# EAGLE design remote_mini (EAGLE 7.6.0)
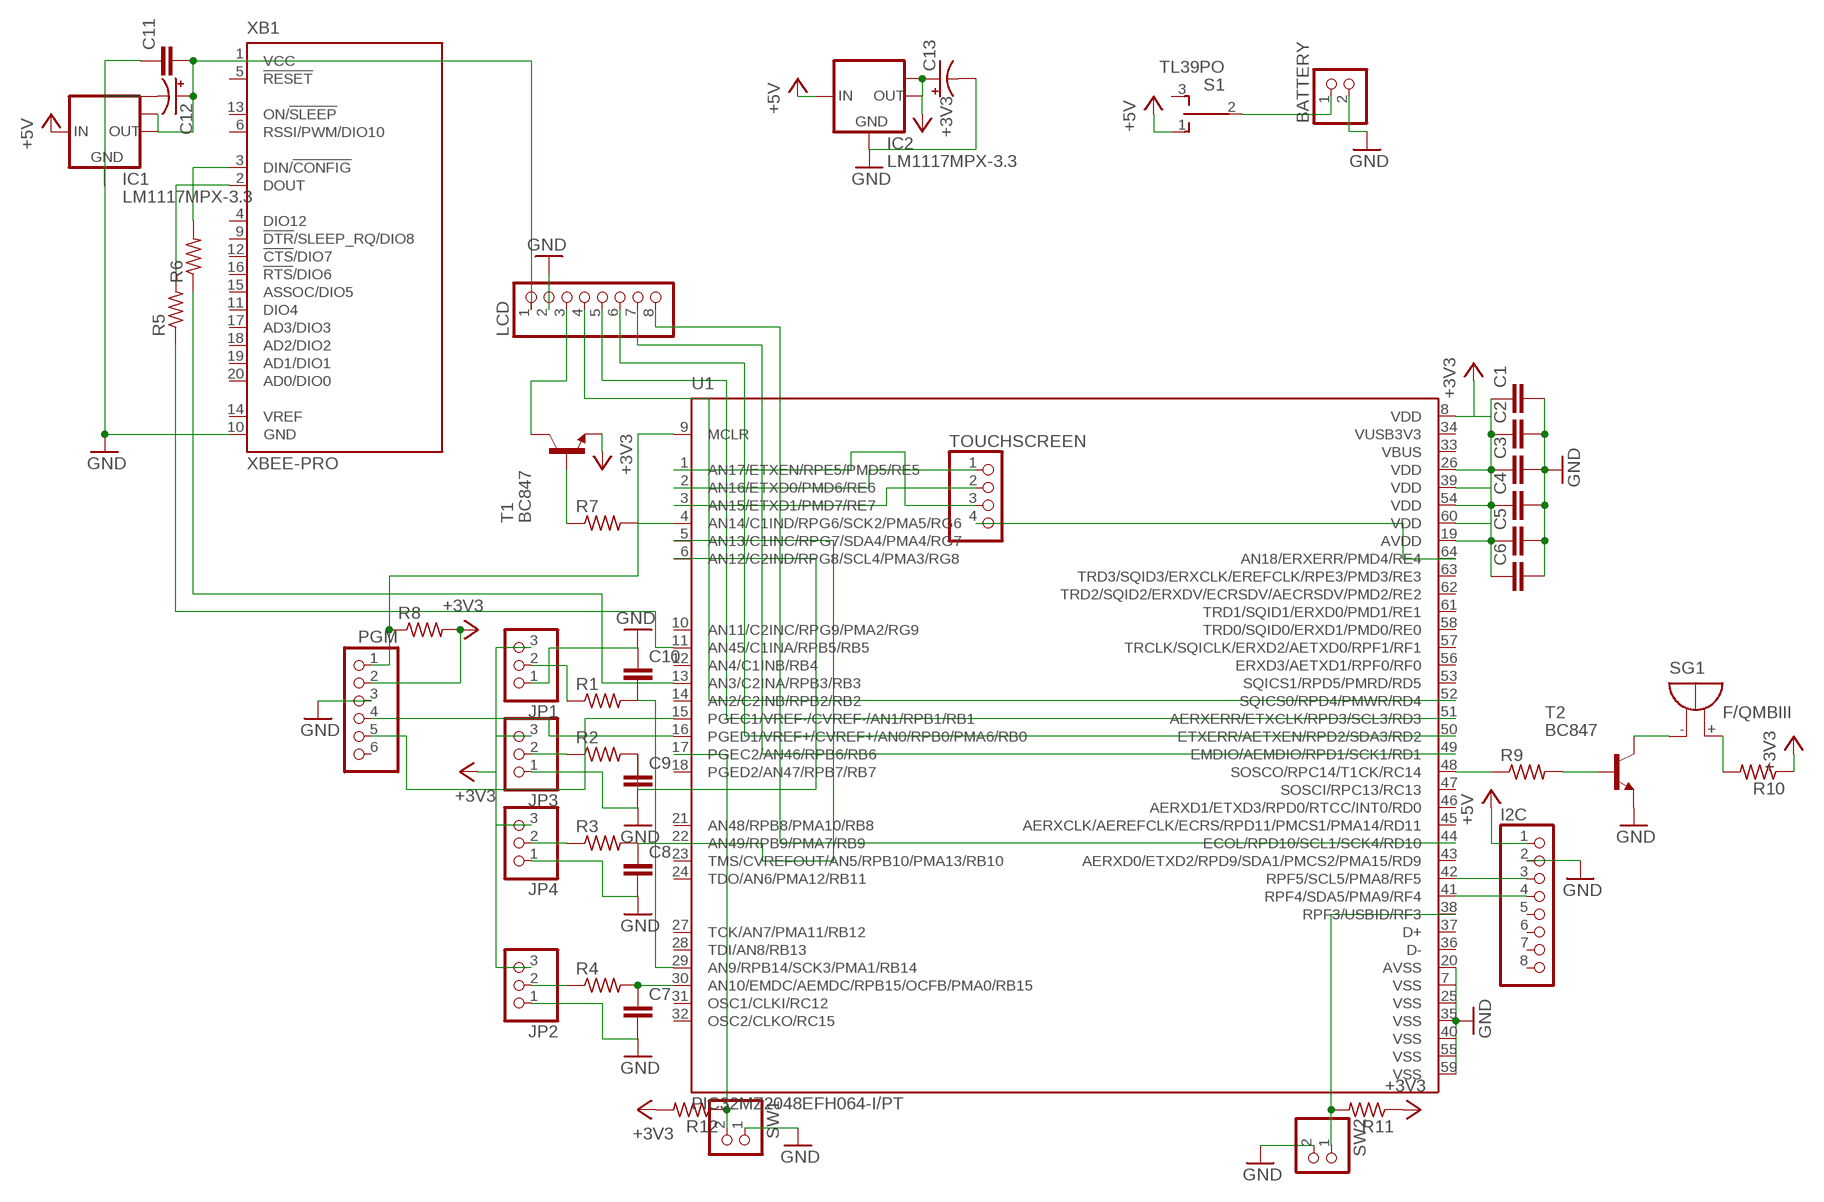
[diagram p0: schematic, sheet 1]

## Parts
BATTERY  PINHD-1X2  [1X02]
C1  C-EUC0603  [C0603]
C2  C-EUC0603  [C0603]
C3  C-EUC0603  [C0603]
C4  C-EUC0603  [C0603]
C5  C-EUC0603  [C0603]
C6  C-EUC0603  [C0603]
C7  C-EUC0805  [C0805]
C8  C-EUC0805  [C0805]
C9  C-EUC0805  [C0805]
C10  C-EUC0805  [C0805]
C11  C-EUC0603  [C0603]
C12  CPOL-USCT7343  [CT7343]
C13  CPOL-USCT7343  [CT7343]
I2C  PINHD-1X8  [1X08]
IC1  LM1117MPX-3.3  [SOT223]
IC2  LM1117MPX-3.3  [SOT223]
JP1  PINHD-1X3  [1X03]
JP2  PINHD-1X3  [1X03]
JP3  PINHD-1X3  [1X03]
JP4  PINHD-1X3  [1X03]
LCD  PINHD-1X8  [1X08]
PGM  PINHD-1X6  [1X06]
R1  R-US_R0603  [R0603]
R2  R-US_R0603  [R0603]
R3  R-US_R0603  [R0603]
R4  R-US_R0603  [R0603]
R5  R-US_R0603  [R0603]
R6  R-US_R0603  [R0603]
R7  R-US_R0603  [R0603]
R8  R-US_R0603  [R0603]
R9  R-US_R0603  [R0603]
R10  R-US_R0603  [R0603]
R11  R-US_R0603  [R0603]
R12  R-US_R0603  [R0603]
S1  TL39PO  [TL3XPO]
SG1  F/QMBIII  [F/QMBIII]
SW1  PINHD-1X2  [1X02]
SW2  PINHD-1X2  [1X02]
T1  BC847  [SOT23]
T2  BC847  [SOT23]
TOUCHSCREEN  PINHD-1X4  [1X04]
U1  PIC32MZ2048EFH064-I/PT  [QFP50P1200X1200X120-64N]
XB1  XBEE-PRO  [XBEE-PRO]

## Nets
+3V3: C1.1 C2.1 C3.1 C4.1 C5.1 C6.1 C13.+ IC2.2(OUT) IC2.TAB(OUT1) JP1.3 JP2.3 JP3.3 JP4.3 PGM.2 R8.2 R10.1 R11.1 R12.2 T1.2(E) U1.8(VDD) U1.19(AVDD) U1.26(VDD) U1.39(VDD) U1.54(VDD) U1.60(VDD)
+5V: I2C.1 IC1.3(IN) IC2.3(IN) S1.1(O)
GND: BATTERY.2 C1.2 C2.2 C3.2 C4.2 C5.2 C6.2 C7.2 C8.2 C9.2 C10.1 C11.1 C12.- C13.- I2C.2 IC1.1(GND) IC2.1(GND) JP1.1 JP2.1 JP3.1 JP4.1 LCD.2 PGM.3 SW1.1 SW2.2 T2.2(E) U1.7(VSS) U1.20(AVSS) U1.25(VSS) U1.35(VSS) U1.40(VSS) U1.55(VSS) U1.59(VSS) XB1.10(GND)
N$1: R9.1 U1.48(SOSCO/RPC14/T1CK/RC14)
N$2: C7.1 R4.2 U1.30(AN10/EMDC/AEMDC/RPB15/OCFB/PMA0/RB15)
N$3: JP2.2 R4.1
N$4: C11.2 C12.+ IC1.2(OUT) IC1.TAB(OUT1) LCD.1 XB1.1(VCC)
N$5: LCD.6 U1.50(ETXERR/AETXEN/RPD2/SDA3/RD2)
N$6: R5.1 U1.11(AN45/C1INA/RPB5/RB5)
N$7: R5.2 XB1.2(DOUT)
N$8: R6.1 U1.13(AN3/C2INA/RPB3/RB3)
N$9: R6.2 XB1.3(DIN/!CONFIG)
N$10: C10.2 R1.2 U1.29(AN9/RPB14/SCK3/PMA1/RB14)
N$11: JP4.2 R3.1
N$12: C8.1 R3.2 U1.5(AN13/C1INC/RPG7/SDA4/PMA4/RG7)
N$13: JP3.2 R2.1
N$14: JP1.2 R1.1
N$15: LCD.5 U1.51(AERXERR/ETXCLK/RPD3/SCL3/RD3)
N$16: LCD.4 U1.52(SQICS0/RPD4/PMWR/RD4)
N$17: LCD.7 U1.49(EMDIO/AEMDIO/RPD1/SCK1/RD1)
N$18: LCD.8 U1.44(ECOL/RPD10/SCL1/SCK4/RD10)
N$19: R7.2 U1.4(AN14/C1IND/RPG6/SCK2/PMA5/RG6)
N$20: R7.1 T1.1(B)
N$21: LCD.3 T1.3(C)
N$22: BATTERY.1 S1.2(P)
N$23: I2C.3 U1.42(RPF5/SCL5/PMA8/RF5)
N$24: I2C.4 U1.41(RPF4/SDA5/PMA9/RF4)
N$25: PGM.1 R8.1 U1.9(MCLR)
N$26: PGM.4 U1.16(PGED1/VREF+/CVREF+/AN0/RPB0/PMA6/RB0)
N$27: PGM.5 U1.15(PGEC1/VREF-/CVREF-/AN1/RPB1/RB1)
N$30: R9.2 T2.1(B)
N$31: C9.1 R2.2 U1.6(AN12/C2IND/RPG8/SCL4/PMA3/RG8)
N$32: SG1.-(+) T2.3(C)
N$33: R10.2 SG1.+(-)
N$34: R11.2 SW2.1 U1.38(RPF3/USBID/RF3)
N$35: R12.1 SW1.2 U1.17(PGEC2/AN46/RPB6/RB6)
N$36: TOUCHSCREEN.3 U1.1(AN17/ETXEN/RPE5/PMD5/RE5)
N$37: TOUCHSCREEN.1 U1.2(AN16/ETXD0/PMD6/RE6)
N$38: TOUCHSCREEN.2 U1.3(AN15/ETXD1/PMD7/RE7)
N$39: TOUCHSCREEN.4 U1.64(AN18/ERXERR/PMD4/RE4)
Unconnected: I2C.5 I2C.6 I2C.7 I2C.8 PGM.6 S1.3(S) U1.10(AN11/C2INC/RPG9/PMA2/RG9) U1.12(AN4/C1INB/RB4) U1.14(AN2/C2INB/RPB2/RB2) U1.18(PGED2/AN47/RPB7/RB7) U1.21(AN48/RPB8/PMA10/RB8) U1.22(AN49/RPB9/PMA7/RB9) U1.23(TMS/CVREFOUT/AN5/RPB10/PMA13/RB10) U1.24(TDO/AN6/PMA12/RB11) U1.27(TCK/AN7/PMA11/RB12) U1.28(TDI/AN8/RB13) U1.31(OSC1/CLKI/RC12) U1.32(OSC2/CLKO/RC15) U1.36(D-) U1.37(D+) U1.43(AERXD0/ETXD2/RPD9/SDA1/PMCS2/PMA15/RD9) U1.45(AERXCLK/AEREFCLK/ECRS/RPD11/PMCS1/PMA14/RD11) U1.46(AERXD1/ETXD3/RPD0/RTCC/INT0/RD0) U1.47(SOSCI/RPC13/RC13) U1.53(SQICS1/RPD5/PMRD/RD5) U1.56(ERXD3/AETXD1/RPF0/RF0) U1.57(TRCLK/SQICLK/ERXD2/AETXD0/RPF1/RF1) U1.58(TRD0/SQID0/ERXD1/PMD0/RE0) U1.61(TRD1/SQID1/ERXD0/PMD1/RE1) U1.62(TRD2/SQID2/ERXDV/ECRSDV/AECRSDV/PMD2/RE2) U1.63(TRD3/SQID3/ERXCLK/EREFCLK/RPE3/PMD3/RE3) XB1.4(DIO12) XB1.5(!RESET) XB1.6(RSSI/PWM/DIO10) XB1.9(!DTR!/SLEEP_RQ/DIO8) XB1.11(DIO4) XB1.12(!CTS!/DIO7) XB1.13(ON/!SLEEP) XB1.14(VREF) XB1.15(ASSOC/DIO5) XB1.16(!RTS!/DIO6) XB1.17(AD3/DIO3) XB1.18(AD2/DIO2) XB1.19(AD1/DIO1) XB1.20(AD0/DIO0)

## Power pins joined to a net without a drawn wire
VBUS: U1.33(VBUS)
VUSB3V3: U1.34(VUSB3V3)

## Library data of the parts
BATTERY SW1 SW2 = pinhead:PINHD-1X2: PIN HEADER
C1-C11 = rcl:C-EU: CAPACITOR, European symbol
C12 C13 = rcl:CPOL-US: POLARIZED CAPACITOR, American symbol
I2C LCD = pinhead:PINHD-1X8: PIN HEADER
IC1 IC2 = lm1117:LM1117MPX-*
JP1-JP4 = pinhead:PINHD-1X3: PIN HEADER
PGM = pinhead:PINHD-1X6: PIN HEADER
R1-R12 = rcl:R-US_: RESISTOR, American symbol
S1 = switch:TL39PO: TINY SWITCH ON OFF ON Source: http://www2.produktinfo.conrad.com/datenblaetter/700000-724999/705152-da-01-de-Subminiaturschalter_TL_36YO.pdf
SG1 = buzzer:F/QMBIII: BUZZER Source: Buerklin; OC_FARNELL: unknown; OC_NEWARK: unknown
T1 T2 = transistor:BC847: NPN TRANSISTOR
TOUCHSCREEN = pinhead:PINHD-1X4: PIN HEADER
U1 = PIC32MZ2048EFH064-I_PT:PIC32MZ2048EFH064-I/PT: PIC32MZ Series 2 MB Flash 512 kB RAM 200 MHz 32-Bit Microcontroller - TQFP-64; AVAILABILITY: Good; DESCRIPTION: PIC32MZ Series 2 MB Flash 512 kB RAM 200 MHz 32-Bit Microcontroller - TQFP-64; MF: Microchip; MP: PIC32MZ2048EFH064-I/PT; PACKAGE: TQFP-64 Microchip; PRICE: 11.29 USD
XB1 = xbee:XBEE: XBee (TM) /XBee-PRO(TM) OEM RF Modules Source: MaxStream, Inc. xbee_productmanual.pdf; MPN: XBP24-AWI-001; OC_FARNELL: 1337916; OC_NEWARK: 42M2667

## Board
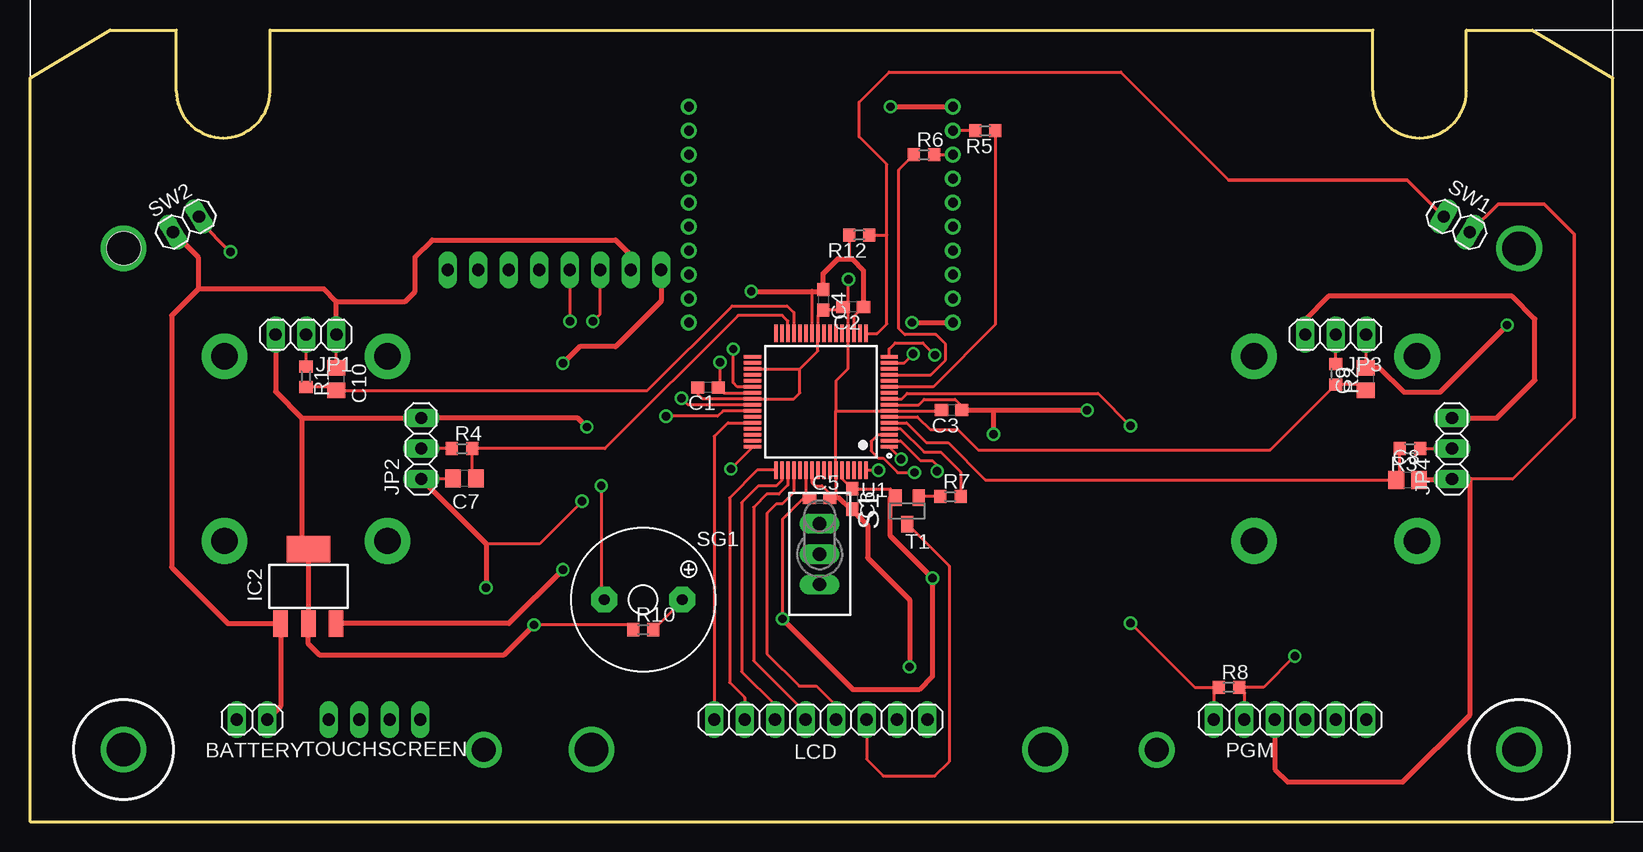
[diagram p1: board, top side]
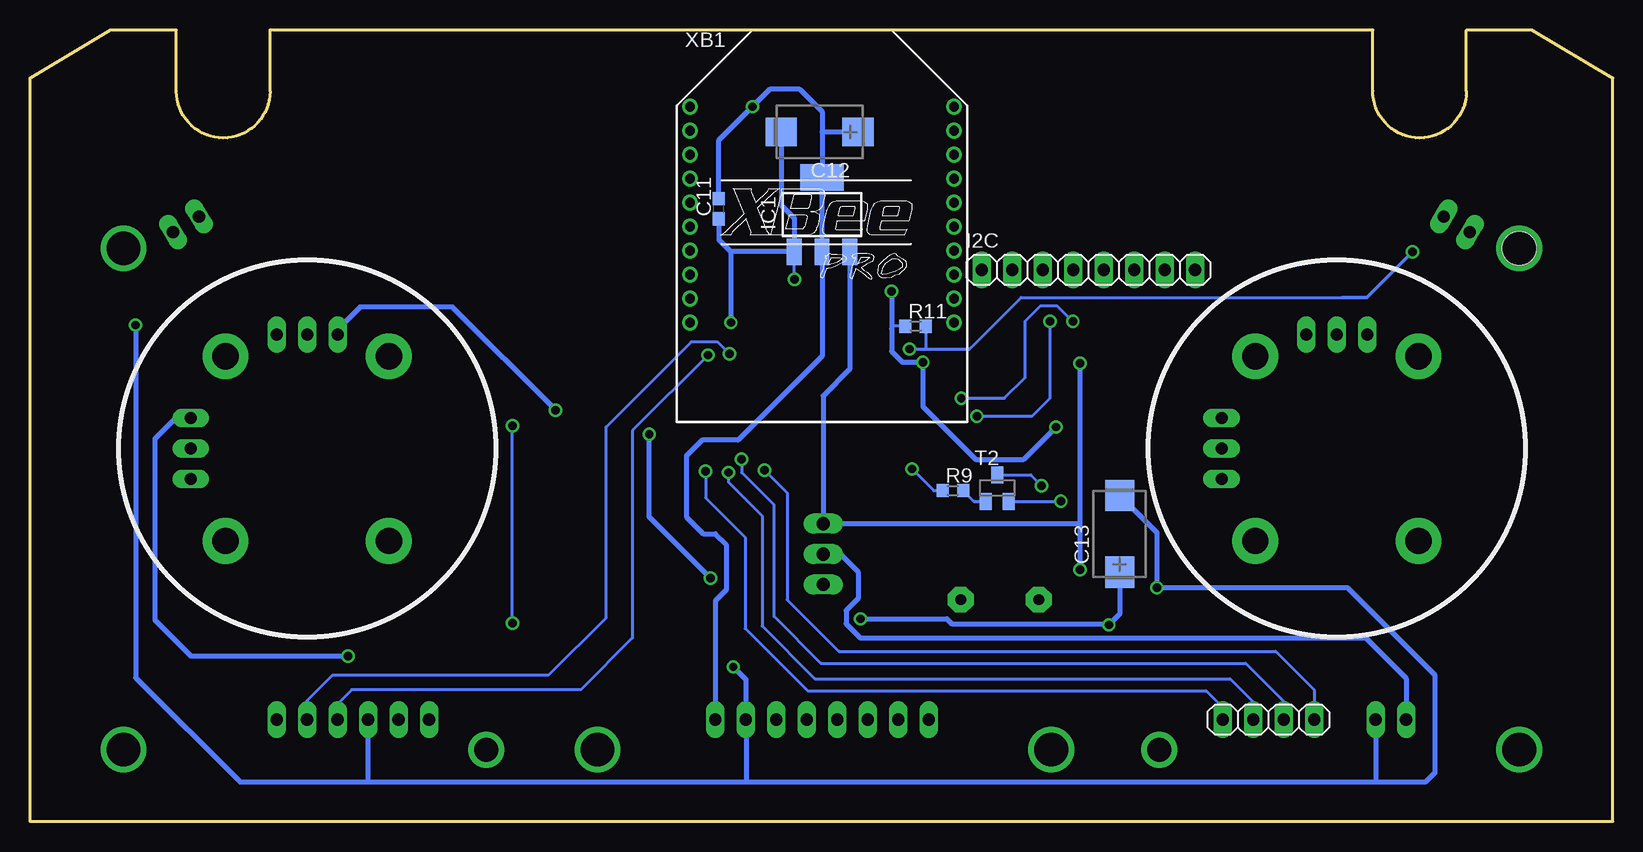
[diagram p2: board, bottom side, seen from below]

Size 131.9 x 66 mm. Coordinates in mm from the lower left corner, seen from the top.
Outline: 0,0 0,62 6.7,66 12.2,66 12.2,60.9 arc90 16.1,57 arc90 20,60.9 20,66 111.9,66 111.9,60.9 arc90 115.8,57 arc90 119.7,60.9 119.7,66 125.2,66 131.9,62 131.9,0 0,0
Copper layers (1*16): Top 0.035mm / dielectric 1.5mm / Bottom 0.035mm
Design rules "default": minimum track width 10mil, minimum drill 24mil, track to track 8mil, track to pad 8mil, pad to pad 8mil, via to via 8mil, smd to smd 8mil, copper to edge 40mil, drill to drill 8mil, minimum pad ring 10mil, minimum via ring 8mil, stop-mask expansion 4mil, vias tented up to drill 0mil, thermal gap 10mil
Holes 2.8 mm at 7.8,47.8

### Footprints (pad centres in the part's own frame; a part is rotated, then mirrored left to right if it is on the bottom)
1X02 = drill 1.016 long: 1 -1.27,0; 2 1.27,0
C0603 = smd 1.1 x 1: 1 -0.85,0; 2 0.85,0
C0805 = smd 1.3 x 1.5: 1 -0.95,0; 2 0.95,0
CT7343 = smd 2.6 x 2.4: + -3.2,0; - 3.2,0
1X08 = drill 1.016 long: 1 -8.89,0; 2 -6.35,0; 3 -3.81,0; 4 -1.27,0; 5 1.27,0; 6 3.81,0; 7 6.35,0; 8 8.89,0
SOT223 = smd 1.219 x 2.235: 1 -2.311,-3.099; 2 0,-3.099; 3 2.311,-3.099 | smd 3.6 x 2.2: TAB 0,3.099
1X03 = drill 1.016 long: 1 -2.54,0; 2 0,0; 3 2.54,0
1X06 = drill 1.016 long: 1 -6.35,0; 2 -3.81,0; 3 -1.27,0; 4 1.27,0; 5 3.81,0; 6 6.35,0
R0603 = smd 1 x 1.1: 1 -0.85,0; 2 0.85,0
TL3XPO = drill 1.1 pad 1.422 long: 1 -2.54,0; 2 0,0; 3 2.54,0
F/QMBIII = drill 0.914 pad 2.159 octagon: + 3.251,0; - -3.251,0
SOT23 = smd 1 x 1.4: 1 -0.95,-1.1; 2 0.95,-1.1; 3 0,1.1
1X04 = drill 1.016 long: 1 -3.81,0; 2 -1.27,0; 3 1.27,0; 4 3.81,0
QFP50P1200X1200X120-64N = smd 1.45 x 0.3: 1 -5.7,3.75; 2 -5.7,3.25; 3 -5.7,2.75; 4 -5.7,2.25; 5 -5.7,1.75; 6 -5.7,1.25; 7 -5.7,0.75; 8 -5.7,0.25; 9 -5.7,-0.25; 10 -5.7,-0.75; 11 -5.7,-1.25; 12 -5.7,-1.75; 13 -5.7,-2.25; 14 -5.7,-2.75; 15 -5.7,-3.25; 16 -5.7,-3.75; 33 5.7,-3.75; 34 5.7,-3.25; 35 5.7,-2.75; 36 5.7,-2.25; 37 5.7,-1.75; 38 5.7,-1.25; 39 5.7,-0.75; 40 5.7,-0.25; 41 5.7,0.25; 42 5.7,0.75; 43 5.7,1.25; 44 5.7,1.75; 45 5.7,2.25; 46 5.7,2.75; 47 5.7,3.25; 48 5.7,3.75 | smd 0.3 x 1.45: 17 -3.75,-5.7; 18 -3.25,-5.7; 19 -2.75,-5.7; 20 -2.25,-5.7; 21 -1.75,-5.7; 22 -1.25,-5.7; 23 -0.75,-5.7; 24 -0.25,-5.7; 25 0.25,-5.7; 26 0.75,-5.7; 27 1.25,-5.7; 28 1.75,-5.7; 29 2.25,-5.7; 30 2.75,-5.7; 31 3.25,-5.7; 32 3.75,-5.7; 49 3.75,5.7; 50 3.25,5.7; 51 2.75,5.7; 52 2.25,5.7; 53 1.75,5.7; 54 1.25,5.7; 55 0.75,5.7; 56 0.25,5.7; 57 -0.25,5.7; 58 -0.75,5.7; 59 -1.25,5.7; 60 -1.75,5.7; 61 -2.25,5.7; 62 -2.75,5.7; 63 -3.25,5.7; 64 -3.75,5.7
XBEE-PRO = drill 0.8 pad 1.27: 1 -11,9; 2 -11,7; 3 -11,5; 4 -11,3; 5 -11,1; 6 -11,-1; 7 -11,-3; 8 -11,-5; 9 -11,-7; 10 -11,-9; 11 11,-9; 12 11,-7; 13 11,-5; 14 11,-3; 15 11,-1; 16 11,1; 17 11,3; 18 11,5; 19 11,7; 20 11,9

### Placement (x,y rotation side)
BATTERY  18.5,8.5 0 top
C1  56.5,36.2 180 top
C2  68.6,42.9 180 top
C3  76.8,34.3 180 top
C4  66.1,43.5 270 top
C5  65.8,27 0 top
C6  68.5,26.9 270 top
C7  36.2,28.6 180 top
C8  114.8,28.5 0 top
C9  111.3,36.9 90 top
C10  25.5,36.9 270 top
C11  74.5,51.1 90 bottom
C12  66.1,57.5 180 bottom
C13  41.1,24 90 bottom
I2C  43.7,46 0 bottom
IC1  65.9,50.6 0 bottom
IC2  23.2,19.6 0 top
JP1  23,40.6 180 top
JP2  32.6,31.1 90 top
JP3  108.8,40.6 180 top
JP4  118.5,31.1 90 top
LCD  65.9,8.5 180 top
PGM  105,8.5 0 top
R1  23,37.1 270 top
R2  108.8,37.3 270 top
R3  115,31.1 180 top
R4  36,31.1 0 top
R5  79.6,57.6 180 top
R6  74.5,55.6 0 top
R7  76.7,27.1 0 top
R8  99.9,11.2 0 top
R9  55,27.6 0 bottom
R10  51.1,16 0 top
R11  58.1,41.3 0 bottom
R12  69.1,48.9 180 top
S1  65.8,22.3 270 top
SG1  51.1,18.5 0 top
SW1  118.9,49.8 149.2 top
SW2  13,49.8 210.8 top
T1  73.1,25.9 180 top
T2  51.3,27.8 0 bottom
TOUCHSCREEN  28.7,8.5 0 bottom
U1  65.9,35 180 top
XB1  65.9,50.6 0 bottom

### Tracks (layer width: path | path; a pad name or v marks a point on that pad's centre or on a via)
+3V3  (via drill 0.7)
  Top 0.254: U1.60 67.65,28.6 C6.1 71.7,27.75 71.7,27 T1.2 | C5.1 64.65,27.1 64.65,27.15 | U1.39 57.8,35.75 C1.1 57.5,36.35 v57.5,38.3 | 65.15,44.2 U1.26 | C2.1 68.65,42.1 U1.19 | U1.54 64.65,27.15 | 64.65,27.15 62.7,25.2 v62.7,16.9 | 66.1,44.2 C4.1 | U1.8 74.05,34.75 74.5,35.2 77.1,35.2 77.65,34.65 C3.1 | R12.2 68.25,46.95 68.2,46.9 | PGM.2 101.19,10.76 R8.2 102.8,11.2 v105.4,13.8 | R10.1 49.85,16.4 v42,16.4
  Top 0.406: JP1.3 20.46,35.84 22.66,33.64 | 22.66,33.64 JP2.3 45.66,33.64 v46.4,32.9 | C3.1 80.4,34.3 | 80.4,34.3 v88.1,34.3 | JP4.3 122.24,33.64 125.4,36.8 125.4,41.9 123.5,43.8 108.2,43.8 106.26,41.86 JP3.3 | v60.1,44.2 65.15,44.2 66.1,44.2 66.1,45.7 67.3,46.9 68.2,46.9 68.5,46.9 69.45,45.95 C2.1 | v80.3,32.3 80.3,34.2 80.4,34.3 | 71.7,27 71.7,23.8 v75.2,20.3 75.2,12.1 74.1,11 68.6,11 v62.7,16.9 | 22.66,33.64 22.66,23.24 IC2.TAB IC2.2 23.2,14.8 24.1,13.9 39.5,13.9 v42,16.4
  Bottom 0.254: R11.1 59.9,41.3 60.1,41.1
  Bottom 0.406: JP4.3 119.76,33.64 121.5,31.9 121.5,16.8 118.5,13.8 v105.4,13.8 | v88.1,34.3 96.7,42.9 104.4,42.9 106.26,41.04 JP3.3 | v46.4,32.9 49.1,30.2 53.1,30.2 57.5,34.6 v57.5,38.3 59.2,38.3 60.1,39.2 60.1,41.1 v60.1,44.2 | v75.2,20.3 80.3,25.4 v80.3,32.3 | v62.7,16.9 55.5,16.9 55.1,16.5 42.1,16.5 v42,16.4 41.1,17.3 C13.+
+5V  (via drill 0.7)
  Top 0.406: I2C.1 52.59,43.39 48.8,39.6 45.8,39.6 v44.4,38.2 | IC2.3 39.9,16.5 v44.4,21
  Bottom 0.406: IC1.3 63.59,37.71 65.8,35.5 S1.1 44.46,24.84 | v44.4,38.2 44.4,24.9 44.46,24.84 | v44.4,21 44.4,24.78 44.46,24.84
GND  (via drill 0.7)
  Top 0.254: C9.2 111.34,37.89 JP3.1 | C8.2 115.81,28.56 | C10.1 25.54,37.89 JP1.1 | C7.2 35.21,28.56 JP2.1 | 68.35,26.05 C6.2 68.5,26 | 67.2,27 67.15,27.05 U1.59 67.15,34.25 | 67.15,34.25 U1.7 75.9,34.25 C3.2 | C2.2 67.5,42.65 C4.2 65.65,42.2 U1.25 65.65,39.25 64.15,37.75 | C2.2 68.15,42.5 U1.20 68.15,37.75 67.15,36.75 67.15,34.25 | C2.2 68.2,43.35 v68.2,45.2 | U1.55 65.15,28.25 65.4,28 66,28 66.65,27.35 C5.2 | U1.35 64.15,37.75 | 64.15,37.75 64.15,35.75 63.65,35.25 U1.40 56.05,35.25 55.65,35.65 C1.2 | v46,26.7 42.46,23.16 38,23.16 | 128.7,33.7 123.56,28.56 120,28.56
  Top 0.305: SW1.1 122.34,51.5 126.2,51.5 128.7,49 128.7,33.7
  Top 0.406: v73.5,41.6 XB1.10 | 68.35,26.05 67.4,27 67.2,27 C5.2 | JP1.1 25.54,43.36 | 25.54,43.36 24.5,44.4 14,44.4 | 14,44.4 11.8,42.2 11.8,21.2 16.5,16.5 IC2.1 20.89,9.62 BATTERY.2 | 25.54,43.36 31.26,43.36 32.1,44.2 32.1,47.1 33.5,48.5 48.8,48.5 50.05,47.25 I2C.2 | PGM.3 103.73,4.37 104.8,3.3 114.4,3.3 120,8.9 120,28.56 JP4.1 118.44,28.5 C8.2 | C9.2 112.45,37.85 114.5,35.8 117.5,35.8 v123.1,41.4 | JP2.1 38,23.16 v38,19.5 | SW2.2 14,47.06 14,44.4 | 68.5,26 69.8,24.7 69.8,22 73.3,18.5 v73.3,12.9
  Bottom 0.254: v68.2,45.2 v68.21,45.21 IC1.1 | T2.2 v46,26.7
  Bottom 0.406: 73.5,47.5 IC1.1 68.21,50.31 69.3,51.4 C12.- | 73.5,47.5 v73.5,41.6 | v123.1,41.4 123.1,12 114.4,3.3 103.73,3.3 | 103.73,3.3 72.2,3.3 | 72.2,3.3 19.7,3.3 | 19.7,3.3 15.6,3.3 14.8,4.1 14.8,12.2 22.1,19.5 v38,19.5 38,24.1 C13.- | 72.2,3.3 72.2,6.05 LCD.2 72.25,11.85 v73.3,12.9 | 103.73,3.3 PGM.3 | BATTERY.2 19.77,3.37 19.7,3.3 | C11.1 74.5,48.5 73.5,47.5
N$1  (via drill 0.7)
  Top 0.254: U1.48 60.2,31.2 v58.4,29.4
  Bottom 0.254: v58.4,29.4 56.6,27.6 R9.1
N$2
  Top 0.254: C7.1 36.85,28.9 R4.2 47.9,31.1 59,42.2 62.7,42.2 63.15,41.75 U1.30
N$3
  Top 0.254: R4.1 JP2.2
N$4  (via drill 0.7)
  Top 0.406: v71.7,59.6 XB1.1
  Bottom 0.406: LCD.1 74.79,18.41 73.9,19.3 73.9,23.1 74.79,23.99 75.79,23.99 77.2,25.4 77.2,30.5 75.9,31.8 72.9,31.8 65.9,38.8 IC1.2 IC1.TAB 65.9,57.5 | C11.2 74.5,56.8 v71.7,59.6 70.2,61.1 67.8,61.1 65.9,59.2 65.9,57.5 | C12.+ 65.9,57.5
N$5
  Top 0.254: U1.50 62.65,28.45 62.2,28 60.7,28 59.3,26.6 59.3,12.5 62.09,9.71 LCD.6
N$6
  Top 0.254: R5.1 80.45,41.45 75.25,36.25 U1.11
N$7
  Top 0.254: R5.2 XB1.2
N$8
  Top 0.254: R6.1 72.4,54.35 72.4,41.1 72.9,40.6 75.5,40.6 76.3,39.8 76.3,38.5 75.05,37.25 U1.13
N$9
  Top 0.254: R6.2 XB1.3
N$10
  Top 0.254: R1.2 25.2,36.25 C10.2 51.45,35.95 58.5,43 63.1,43 63.65,42.45 U1.29
N$11
  Top 0.254: R3.1 JP4.2
N$12
  Top 0.254: R3.2 114.15,28.8 C8.1 79.6,28.5 76.5,31.6 74.7,31.6 73.05,33.25 U1.5
N$13
  Top 0.254: R2.1 JP3.2
N$14
  Top 0.254: R1.1 JP1.2
N$15
  Top 0.254: U1.51 63.15,28.05 62.4,27.3 61.4,27.3 60.3,26.2 60.3,13.4 64.63,9.07 LCD.5
N$16
  Top 0.254: U1.52 63.65,27.45 62.7,26.5 62.2,26.5 61.4,25.7 61.4,14 64.1,11.3 65.5,11.3 67.17,9.63 LCD.4
N$17
  Top 0.254: U1.49 60.6,29.3 58.3,27 58.3,11.6 59.55,10.35 LCD.7
N$18
  Top 0.254: U1.44 58.15,33.25 57.01,32.11 LCD.8
N$19
  Top 0.254: U1.4 72.55,32.75 74.5,30.8 75.9,30.8 77.55,29.15 R7.2
N$20
  Top 0.254: R7.1 74.15,27.1 T1.1
  Top 0.406: 74.2,27.15 T1.1
N$21
  Top 0.254: LCD.3 69.71,5.19 71.1,3.8 75.4,3.8 76.6,5 76.6,21.3 T1.3
N$22
  Bottom 0.406: S1.2 64.4,22.3 62.9,20.8 62.9,18.6 63.9,17.6 63.9,16.5 62.7,15.3 20.6,15.3 17.23,11.93 BATTERY.1
N$23  (via drill 0.7)
  Top 0.254: U1.42 57.75,34.25 57.3,33.8 v53,33.8 | v46.9,41.7 47.51,42.31 I2C.3
  Bottom 0.254: v53,33.8 48.4,33.8 46.9,35.3 v46.9,41.7
N$24  (via drill 0.7)
  Top 0.254: U1.41 54.85,34.75 v54.3,35.3 | v45,41.7 45,46 I2C.4
  Bottom 0.254: v54.3,35.3 50.7,35.3 49,37 49,41.7 47.7,43 46.3,43 v45,41.7
N$25  (via drill 0.7)
  Top 0.254: v91.7,33 89,35.7 73.1,35.7 72.65,35.25 U1.9 | PGM.1 98.65,10.8 R8.1 97.05,11.2 v91.7,16.55
  Bottom 0.254: v91.7,16.55 v91.7,33
N$26  (via drill 0.7)
  Top 0.254: U1.16 71.6,39.4 72.1,39.9 74.4,39.9 v75.4,38.9
  Bottom 0.254: v75.4,38.9 81.7,32.6 81.7,15.3 86,11 105.1,11 106.27,9.83 PGM.4
N$27  (via drill 0.7)
  Top 0.254: U1.15 72.85,38.25 v73.6,39
  Bottom 0.254: v73.6,39 74.6,40 76.8,40 83.9,32.9 83.9,17 88.7,12.2 106.7,12.2 108.81,10.09 PGM.5
N$28  (via drill 2)
  other vias: 93.9,6
N$29  (via drill 2)
  other vias: 37.8,6
N$30
  Bottom 0.254: R9.2 53.25,26.7 T2.1
N$31
  Top 0.254: U1.6 73.95,33.75 75,32.7 77.3,32.7 79,31 103.35,31 R2.2 110.8,36.45 C9.1
N$32  (via drill 0.7)
  Top 0.254: v47.6,28 47.6,18.75 SG1.-
  Bottom 0.254: T2.3 48.5,28.9 v47.6,28
N$33
  Top 0.254: SG1.+ 54.35,18.4 R10.2
N$34  (via drill 0.7)
  Top 0.254: U1.38 58.95,36.25 58.6,36.6 v58.6,39.4
  Top 0.305: v16.7,47.5 14.09,50.11 SW2.1
  Bottom 0.254: v58.6,39.4 57.2,39.4 | 57.2,39.4 53.6,39.4 49.3,43.7 22.54,43.7 | R11.2 57.25,39.45 57.2,39.4
  Bottom 0.305: 22.54,43.7 20.5,43.7 v16.7,47.5
N$35
  Top 0.254: U1.17 70.6,40.7 71.4,41.5 71.4,48.9 | 71.4,48.9 71.4,54.8 69.1,57.1 69.1,60 71.6,62.5 90.9,62.5 99.9,53.5 | R12.1 71.4,48.9
  Top 0.305: SW1.2 114.76,53.5 99.9,53.5
N$36  (via drill 0.7)
  Top 0.254: U1.1 72.6,30.25 v72.6,30.2
  Bottom 0.254: TOUCHSCREEN.3 27.43,10.03 30.6,13.2 66,13.2 69.9,17.1 69.9,26.4 72.6,29.1 v72.6,30.2
N$37  (via drill 0.7)
  Top 0.254: U1.2 72.55,31.75 74.2,30.1 75.2,30.1 75.6,29.7 v75.6,29.2
  Bottom 0.254: TOUCHSCREEN.1 32.51,9.51 33.9,10.9 67.1,10.9 72.3,16.1 72.3,23.7 75.6,27 v75.6,29.2
N$38  (via drill 0.7)
  Top 0.254: U1.3 70.65,32.25 70.1,31.7 70.1,30.9 70.7,30.3 71.1,30.3 72.3,29.1 v73.7,29.1
  Bottom 0.254: TOUCHSCREEN.2 29.97,9.97 31.9,11.9 66.5,11.9 70.9,16.3 70.9,25.5 73.7,28.3 v73.7,29.1
N$39  (via drill 0.7)
  Top 0.254: U1.64 v70.7,29.3
  Bottom 0.254: v70.7,29.3 68.8,27.4 68.8,18.5 64.5,14.2 28.1,14.2 24.89,10.99 TOUCHSCREEN.4
S$1  (via drill 2.2 pad 3.81)
  other vias: 115.6,38.8
S$2  (via drill 2.2 pad 3.81)
  other vias: 16.2,38.8
S$3  (via drill 2.2 pad 3.81)
  other vias: 16.2,23.4
S$4  (via drill 2.2 pad 3.81)
  other vias: 29.8,23.4
S$5  (via drill 2.2 pad 3.81)
  other vias: 29.8,38.8
S$6  (via drill 2.2 pad 3.81)
  other vias: 102,38.8
S$7  (via drill 2.2 pad 3.81)
  other vias: 102,23.4
S$8  (via drill 2.2 pad 3.81)
  other vias: 115.6,23.4
S$9  (via drill 2.8 pad 3.81)
  other vias: 46.8,6
S$10  (via drill 2.8 pad 3.81)
  other vias: 7.8,6
S$11  (via drill 2.8 pad 3.81)
  other vias: 7.8,47.8
S$12  (via drill 2.8 pad 3.81)
  other vias: 124.1,47.8
S$13  (via drill 2.8 pad 3.81)
  other vias: 124.1,6
S$14  (via drill 2.8 pad 3.81)
  other vias: 84.6,6